# EAGLE design pt1MX (EAGLE 6.4)
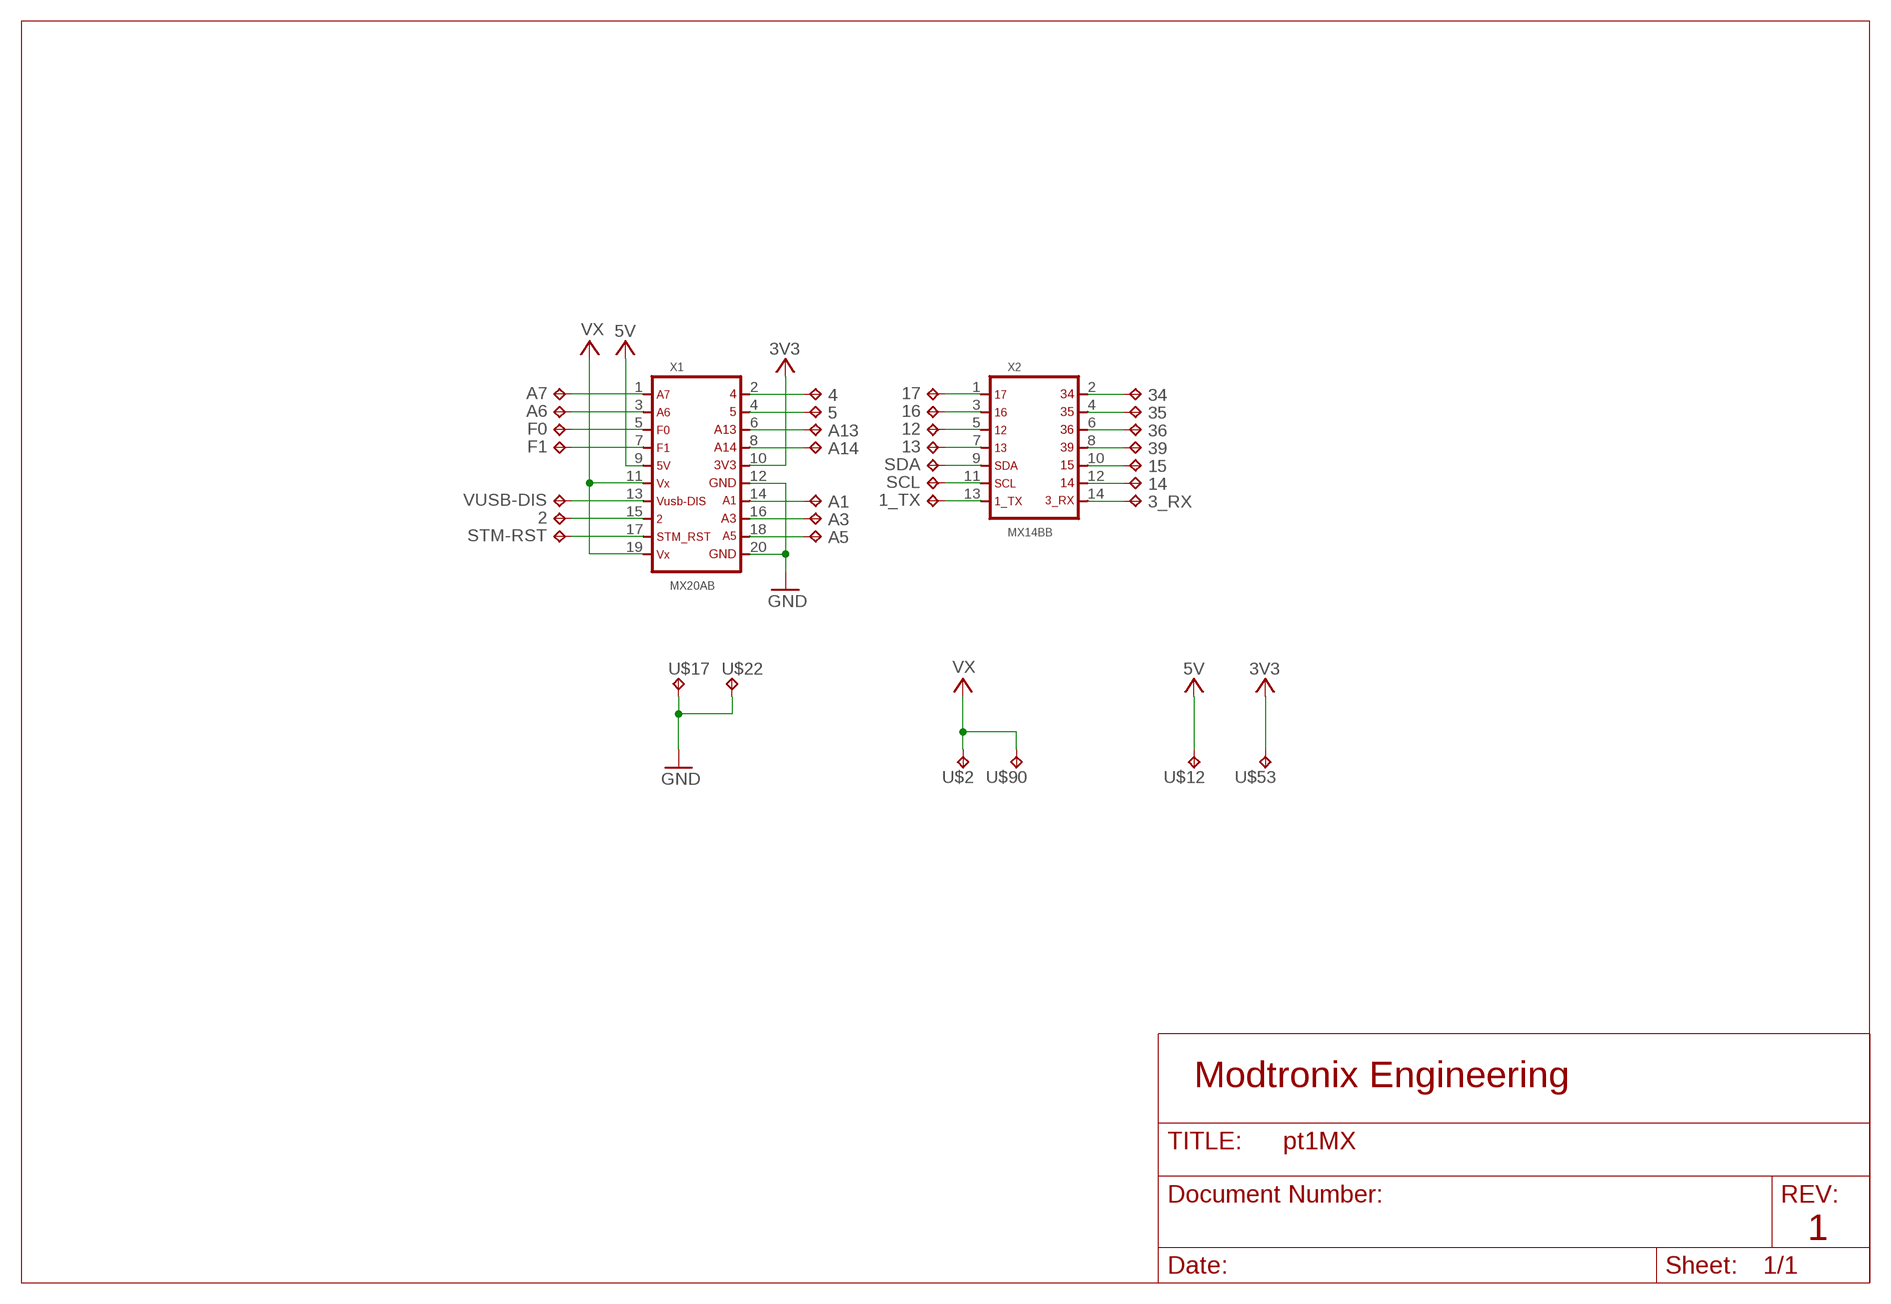
[diagram p0: schematic, sheet 1]

## Parts
1_TX  TPD10-D200  [TP-10-D200]
2  TPD10-D200  [TP-10-D200]
3_RX  TPD10-D200  [TP-10-D200]
4  TPD10-D200  [TP-10-D200]
5  TPD10-D200  [TP-10-D200]
12  TPD10-D200  [TP-10-D200]
13  TPD10-D200  [TP-10-D200]
14  TPD10-D200  [TP-10-D200]
15  TPD10-D200  [TP-10-D200]
16  TPD10-D200  [TP-10-D200]
17  TPD10-D200  [TP-10-D200]
34  TPD10-D200  [TP-10-D200]
35  TPD10-D200  [TP-10-D200]
36  TPD10-D200  [TP-10-D200]
39  TPD10-D200  [TP-10-D200]
A1  TPD10-D200  [TP-10-D200]
A3  TPD10-D200  [TP-10-D200]
A5  TPD10-D200  [TP-10-D200]
A6  TPD10-D200  [TP-10-D200]
A7  TPD10-D200  [TP-10-D200]
A13  TPD10-D200  [TP-10-D200]
A14  TPD10-D200  [TP-10-D200]
F0  TPD10-D200  [TP-10-D200]
F1  TPD10-D200  [TP-10-D200]
SCL  TPD10-D200  [TP-10-D200]
SDA  TPD10-D200  [TP-10-D200]
STM-RST  TPD10-D200  [TP-10-D200]
U$2  TPD10-D200  [TP-10-D200]
U$12  TPD10-D200  [TP-10-D200]
U$17  TPD10-D200  [TP-10-D200]
U$22  TPD10-D200  [TP-10-D200]
U$53  TPD10-D200  [TP-10-D200]
U$90  TPD10-D200  [TP-10-D200]
VUSB-DIS  TPD10-D200  [TP-10-D200]
X1  MX20AB  [MA10-2-NONUM]
X2  MX14BB  [MA07-2-NONUM]

## Nets
1_TX: 1_TX.1(TP) X2.13
2: 2.1(TP) X1.15
3_RX: 3_RX.1(TP) X2.14
3V3: U$53.1(TP) X1.10
4: 4.1(TP) X1.2
5: 5.1(TP) X1.4
5V [power]: U$12.1(TP) X1.9
12: 12.1(TP) X2.5
13: 13.1(TP) X2.7
14: 14.1(TP) X2.12
15: 15.1(TP) X2.10
16: 16.1(TP) X2.3
17: 17.1(TP) X2.1
34: 34.1(TP) X2.2
35: 35.1(TP) X2.4
36: 36.1(TP) X2.6
39: 39.1(TP) X2.8
A1: A1.1(TP) X1.14
A3: A3.1(TP) X1.16
A5: A5.1(TP) X1.18
A6: A6.1(TP) X1.3
A7: A7.1(TP) X1.1
A13: A13.1(TP) X1.6
A14: A14.1(TP) X1.8
F0: F0.1(TP) X1.5
F1: F1.1(TP) X1.7
GND [power]: U$17.1(TP) U$22.1(TP) X1.12 X1.20
SCL: SCL.1(TP) X2.11
SDA: SDA.1(TP) X2.9
STM-RST: STM-RST.1(TP) X1.17
VUSB-DIS: VUSB-DIS.1(TP) X1.13
VX [power]: U$2.1(TP) U$90.1(TP) X1.11 X1.19

## Notes on the sheet
- Modtronix Engineering
- 1

## Library data of the parts
1_TX 2 3_RX 4 5 12-17 34-36 39 A1 A3 A5-A7 A13 A14 F0 F1 SCL SDA STM-RST U$2 U$12 U$17 U$22 U$53 U$90 VUSB-DIS = mx-conn:TP
X1 = mx-conn:MX20A
X2 = mx-conn:MX14B

## Net classes
0 default: width 0.2 mm, drill 0.5 mm, clearance 0.2 mm
1 power: width 0.3 mm, drill 0.5 mm, clearance 0.2 mm

## Board
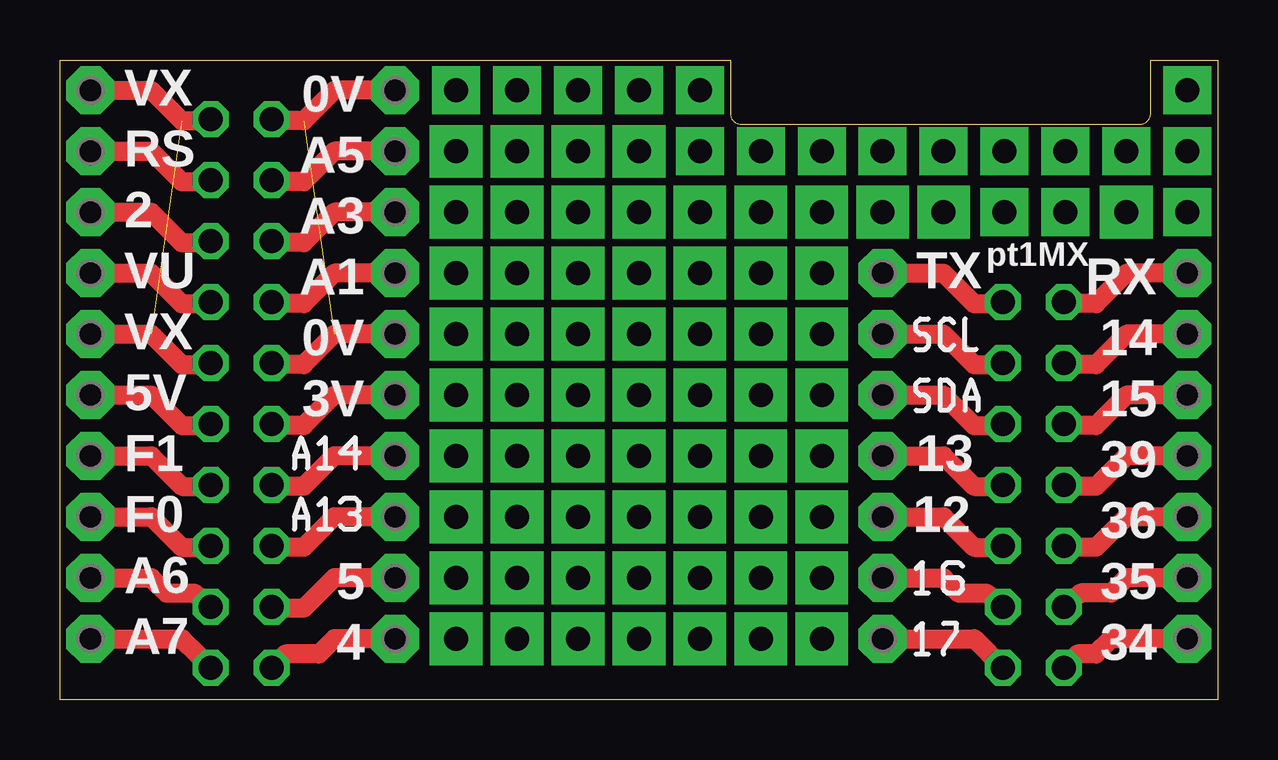
[diagram p1: board, top side]
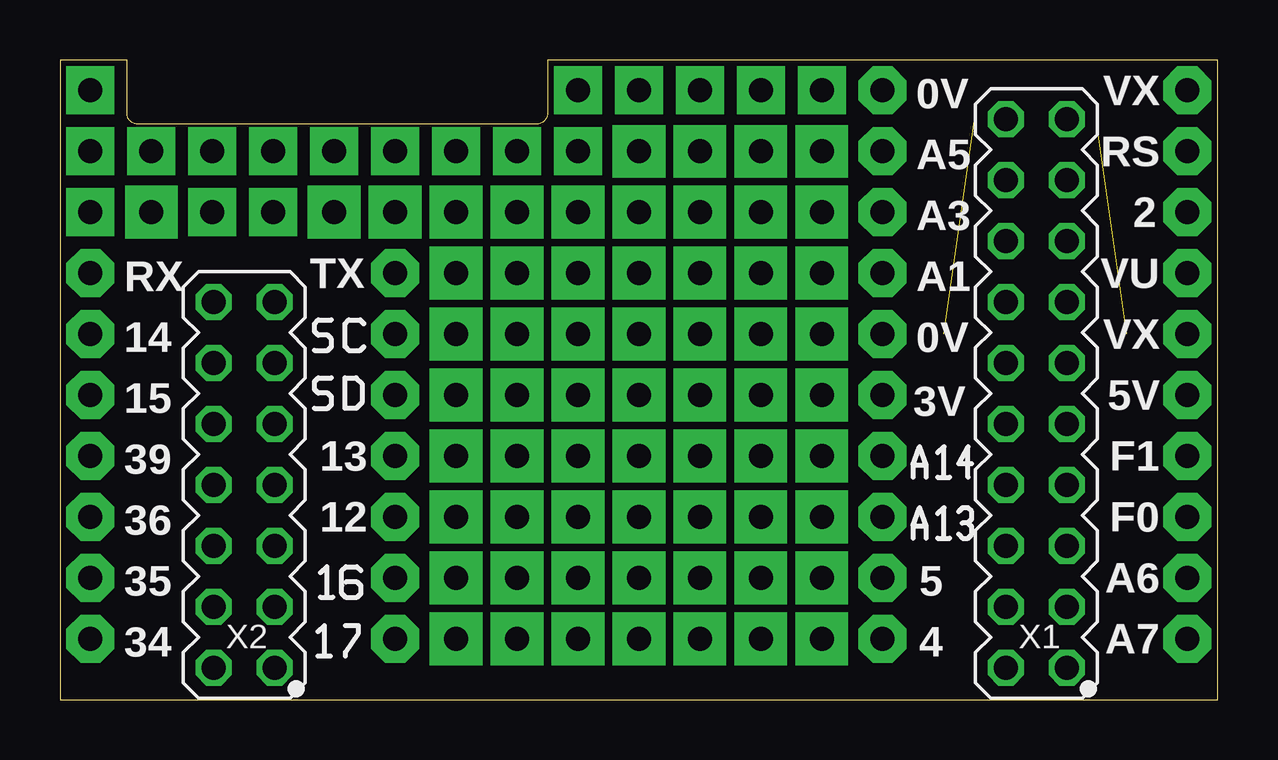
[diagram p2: board, bottom side, seen from below]

Size 48.26 x 26.67 mm. Coordinates in mm from the lower left corner, seen from the top.
Outline: 0,0 0,26.67 27.94,26.67 27.94,24.38 arc74 28.32,24 45.08,24 arc74 45.47,24.38 45.47,26.67 48.26,26.67 48.26,0 0,0
Copper layers (1*16): Top 0.035mm / dielectric 1.5mm / Bottom 0.035mm
Design rules "12w_10clr_24drl *": minimum track width 0.2mm, minimum drill 0.5mm, track to track 10mil, track to pad 10mil, pad to pad 10mil, via to via 12mil, smd to smd 6mil, copper to edge 0.1mm, drill to drill 0.1mm, minimum pad ring 0.2mm, minimum via ring 0.2mm, stop-mask expansion 4mil, vias tented up to drill 28mil, thermal gap 10mil

### Footprints (pad centres in the part's own frame; a part is rotated, then mirrored left to right if it is on the bottom)
TP-10-D200 = drill 1 pad 2 octagon: 1 0,0
MA10-2-NONUM = drill 1 octagon: 1 -11.43,-1.27; 2 -11.43,1.27; 3 -8.89,-1.27; 4 -8.89,1.27; 5 -6.35,-1.27; 6 -6.35,1.27; 7 -3.81,-1.27; 8 -3.81,1.27; 9 -1.27,-1.27; 10 -1.27,1.27; 11 1.27,-1.27; 12 1.27,1.27; 13 3.81,-1.27; 14 3.81,1.27; 15 6.35,-1.27; 16 6.35,1.27; 17 8.89,-1.27; 18 8.89,1.27; 19 11.43,-1.27; 20 11.43,1.27
MA07-2-NONUM = drill 1 octagon: 1 -7.62,-1.27; 2 -7.62,1.27; 3 -5.08,-1.27; 4 -5.08,1.27; 5 -2.54,-1.27; 6 -2.54,1.27; 7 0,-1.27; 8 0,1.27; 9 2.54,-1.27; 10 2.54,1.27; 11 5.08,-1.27; 12 5.08,1.27; 13 7.62,-1.27; 14 7.62,1.27

### Placement (x,y rotation side)
1_TX  34.29,17.78 270 top
2  1.27,20.32 270 top
3_RX  46.99,17.78 270 top
4  13.97,2.54 270 top
5  13.97,5.08 270 top
12  34.29,7.62 270 top
13  34.29,10.16 270 top
14  46.99,15.24 180 top
15  46.99,12.7 180 top
16  34.29,5.08 270 top
17  34.29,2.54 270 top
34  46.99,2.54 0 top
35  46.99,5.08 270 top
36  46.99,7.62 270 top
39  46.99,10.16 0 top
A1  13.97,17.78 270 top
A3  13.97,20.32 270 top
A5  13.97,22.86 270 top
A6  1.27,5.08 270 top
A7  1.27,2.54 270 top
A13  13.97,7.62 270 top
A14  13.97,10.16 270 top
F0  1.27,7.62 270 top
F1  1.27,10.16 270 top
SCL  34.29,15.24 270 top
SDA  34.29,12.7 270 top
STM-RST  1.27,22.86 270 top
U$1  [S-56N]  35.69,14.61 0 top
U$2  1.27,15.24 90 top
U$3  [ESP32MX_20-14P_0H_REF]  24.13,6.99 0 top
U$4  [S-56N]  35.69,12.07 0 top
U$5  [C-56N]  36.7,14.61 0 top
U$6  [D-56N]  36.7,12.07 0 top
U$7  [A-56N]  37.72,12.07 0 top
U$8  [L-56N]  37.72,14.61 0 top
U$9  [A-56N]  12.7,9.27 0 bottom
U$10  [A-56N]  9.78,9.65 0 top
U$11  [A-56N]  9.78,7.11 0 top
U$12  1.27,12.7 90 top
U$13  [A-56N]  12.7,6.73 0 bottom
U$14  [4-56N]  10.79,9.27 0 bottom
U$17  13.97,15.24 0 top
U$22  13.97,25.4 0 top
U$23  [3-56N]  10.79,6.73 0 bottom
U$37  [3-56]  11.68,7.11 0 top
U$39  [4-56]  11.68,9.65 0 top
U$41  [1-56N]  10.79,7.11 0 top
U$42  [1-56N]  10.79,9.65 0 top
U$48  [1-56N]  35.69,4.45 0 top
U$49  [6-56]  36.83,4.45 0 top
U$50  [1-56N]  35.69,1.91 0 top
U$51  [S-56]  37.65,12.14 0 bottom
U$52  [7-56N]  36.83,1.91 0 top
U$53  13.97,12.7 0 top
U$54  [S-56]  37.65,14.56 0 bottom
U$55  [D-56]  36.38,12.14 0 bottom
U$57  [C-56]  36.38,14.56 0 bottom
U$61  [1-56N]  37.4,4.27 0 bottom
U$62  [6-56]  36.51,4.27 0 bottom
U$63  [1-56N]  37.5,1.82 0 bottom
U$64  [7-56N]  36.36,1.82 0 bottom
U$68  [1-56N]  11.68,6.73 0 bottom
U$69  [1-56N]  11.68,9.27 0 bottom
U$90  1.27,25.4 0 top
VUSB-DIS  1.27,17.78 270 top
X1  7.56,12.77 90 bottom
X2  40.58,8.96 90 bottom

### Tracks (layer width: path | path; a pad name or v marks a point on that pad's centre or on a via)
1_TX
  Top 0.8: 1_TX.1 36.83,17.78 38.1,16.51 39.24,16.51 X2.13
2
  Top 0.8: 2.1 3.81,20.32 5.08,19.05 6.22,19.05 X1.15
3_RX
  Top 0.8: 3_RX.1 44.45,17.78 43.18,16.51 41.91,16.51 X2.14
3V3
  Top 0.8: U$53.1 11.43,12.7 10.16,11.43 8.89,11.43 X1.10
4
  Top 0.8: 4.1 11.43,2.54 10.79,1.91 9.4,1.91 X1.2
5
  Top 0.8: 5.1 11.43,5.08 10.16,3.81 8.89,3.81 X1.4
5V
  Top 0.8: U$12.1 3.81,12.7 5.08,11.43 6.22,11.43 X1.9
12
  Top 0.8: 12.1 36.83,7.62 38.1,6.35 39.24,6.35 X2.5
13
  Top 0.8: 13.1 36.83,10.16 38.1,8.89 39.24,8.89 X2.7
14
  Top 0.8: 14.1 44.45,15.24 43.18,13.97 41.91,13.97 X2.12
15
  Top 0.8: 15.1 44.45,12.7 43.18,11.43 41.91,11.43 X2.10
16
  Top 0.8: 16.1 36.83,5.08 37.47,4.45 38.61,4.45 X2.3
17
  Top 0.8: 17.1 38.1,2.54 X2.1
34
  Top 0.8: 34.1 43.81,2.54 43.18,1.91 42.42,1.91 X2.2
35
  Top 0.8: 35.1 44.45,5.08 43.81,4.45 42.55,4.45 X2.4
36
  Top 0.8: 36.1 44.45,7.62 43.18,6.35 41.91,6.35 X2.6
39
  Top 0.8: 39.1 44.45,10.16 43.18,8.89 41.91,8.89 X2.8
A1
  Top 0.8: A1.1 11.43,17.78 10.16,16.51 8.89,16.51 X1.14
A3
  Top 0.8: A3.1 11.43,20.32 10.16,19.05 8.89,19.05 X1.16
A5
  Top 0.8: A5.1 11.43,22.86 10.16,21.59 8.89,21.59 X1.18
A6
  Top 0.8: A6.1 3.81,5.08 4.45,4.45 5.59,4.45 X1.3
A7
  Top 0.8: A7.1 5.08,2.54 5.71,1.91 5.72,1.91 X1.1
A13
  Top 0.8: A13.1 11.43,7.62 10.16,6.35 8.89,6.35 X1.6
A14
  Top 0.8: A14.1 11.43,10.16 10.16,8.89 8.89,8.89 X1.8
F0
  Top 0.8: F0.1 3.81,7.62 5.08,6.35 6.22,6.35 X1.5
F1
  Top 0.8: F1.1 3.81,10.16 5.08,8.89 6.22,8.89 X1.7
GND  (1 unrouted)
  Top 0.8: U$17.1 11.43,15.24 10.16,13.97 8.89,13.97 X1.12 | U$22.1 11.43,25.4 10.16,24.13 8.89,24.13 X1.20
N$1  (via drill 1 pad 2.2)
  other vias: 21.59,10.16
N$2  (via drill 1 pad 2.2)
  other vias: 24.13,10.16
N$3  (via drill 1 pad 2.2)
  other vias: 26.67,10.16
N$4  (via drill 1 pad 2.2)
  other vias: 26.67,7.62
N$5  (via drill 1 pad 2.2)
  other vias: 24.13,7.62
N$6  (via drill 1 pad 2.2)
  other vias: 21.59,7.62
N$7  (via drill 1 pad 2.2)
  other vias: 21.59,5.08
N$8  (via drill 1 pad 2.2)
  other vias: 24.13,5.08
N$9  (via drill 1 pad 2.2)
  other vias: 26.67,5.08
N$255  (via drill 1 pad 2)
  other vias: 46.99,25.4
N$300  (via drill 1 pad 2)
  other vias: 44.45,22.86
N$301  (via drill 1 pad 2)
  other vias: 46.99,22.86
N$332  (via drill 1 pad 2)
  other vias: 34.29,22.86
N$333  (via drill 1 pad 2)
  other vias: 36.83,22.86
N$334  (via drill 1 pad 2.2)
  other vias: 44.45,20.32
N$335  (via drill 1 pad 2)
  other vias: 46.99,20.32
N$374  (via drill 1 pad 2)
  other vias: 16.51,25.4
N$375  (via drill 1 pad 2.2)
  other vias: 16.51,22.86
N$376  (via drill 1 pad 2.2)
  other vias: 19.05,22.86
N$377  (via drill 1 pad 2)
  other vias: 19.05,25.4
N$380  (via drill 1 pad 2)
  other vias: 21.59,25.4
N$381  (via drill 1 pad 2.2)
  other vias: 21.59,22.86
N$382  (via drill 1 pad 2.2)
  other vias: 34.29,20.32
N$383  (via drill 1 pad 2)
  other vias: 41.91,20.32
N$384  (via drill 1 pad 2)
  other vias: 39.37,20.32
N$385  (via drill 1 pad 2.2)
  other vias: 36.83,20.32
N$389  (via drill 1 pad 2.2)
  other vias: 29.21,5.08
N$394  (via drill 1 pad 2.2)
  other vias: 16.51,2.54
N$398  (via drill 1 pad 2.2)
  other vias: 31.75,2.54
N$399  (via drill 1 pad 2.2)
  other vias: 21.59,2.54
N$400  (via drill 1 pad 2.2)
  other vias: 29.21,2.54
N$401  (via drill 1 pad 2.2)
  other vias: 19.05,5.08
N$402  (via drill 1 pad 2.2)
  other vias: 16.51,5.08
N$403  (via drill 1 pad 2.2)
  other vias: 19.05,2.54
N$404  (via drill 1 pad 2.2)
  other vias: 24.13,2.54
N$405  (via drill 1 pad 2.2)
  other vias: 26.67,2.54
N$424  (via drill 1 pad 2.2)
  other vias: 16.51,7.62
N$425  (via drill 1 pad 2.2)
  other vias: 19.05,7.62
N$426  (via drill 1 pad 2.2)
  other vias: 19.05,10.16
N$430  (via drill 1 pad 2.2)
  other vias: 29.21,10.16
N$431  (via drill 1 pad 2.2)
  other vias: 31.75,10.16
N$434  (via drill 1 pad 2.2)
  other vias: 31.75,12.7
N$435  (via drill 1 pad 2.2)
  other vias: 29.21,12.7
N$436  (via drill 1 pad 2.2)
  other vias: 26.67,12.7
N$437  (via drill 1 pad 2.2)
  other vias: 24.13,12.7
N$438  (via drill 1 pad 2.2)
  other vias: 21.59,12.7
N$439  (via drill 1 pad 2.2)
  other vias: 19.05,12.7
N$440  (via drill 1 pad 2.2)
  other vias: 16.51,10.16
N$441  (via drill 1 pad 2.2)
  other vias: 16.51,12.7
N$444  (via drill 1 pad 2.2)
  other vias: 16.51,15.24
N$445  (via drill 1 pad 2.2)
  other vias: 16.51,17.78
N$448  (via drill 1 pad 2.2)
  other vias: 16.51,20.32
N$449  (via drill 1 pad 2.2)
  other vias: 19.05,20.32
N$450  (via drill 1 pad 2.2)
  other vias: 19.05,17.78
N$451  (via drill 1 pad 2.2)
  other vias: 19.05,15.24
N$452  (via drill 1 pad 2.2)
  other vias: 21.59,15.24
N$453  (via drill 1 pad 2.2)
  other vias: 21.59,17.78
N$454  (via drill 1 pad 2.2)
  other vias: 21.59,20.32
N$455  (via drill 1 pad 2.2)
  other vias: 24.13,17.78
N$456  (via drill 1 pad 2.2)
  other vias: 24.13,15.24
N$457  (via drill 1 pad 2.2)
  other vias: 26.67,15.24
N$458  (via drill 1 pad 2.2)
  other vias: 26.67,17.78
N$459  (via drill 1 pad 2.2)
  other vias: 29.21,17.78
N$460  (via drill 1 pad 2.2)
  other vias: 29.21,15.24
N$461  (via drill 1 pad 2.2)
  other vias: 31.75,15.24
N$462  (via drill 1 pad 2.2)
  other vias: 31.75,17.78
N$465  (via drill 1 pad 2)
  other vias: 41.91,22.86
N$466  (via drill 1 pad 2)
  other vias: 39.37,22.86
N$469  (via drill 1 pad 2.2)
  other vias: 31.75,7.62
N$470  (via drill 1 pad 2.2)
  other vias: 29.21,7.62
N$472  (via drill 1 pad 2.2)
  other vias: 31.75,5.08
N$475  (via drill 1 pad 2.2)
  other vias: 24.13,22.86
N$476  (via drill 1 pad 2)
  other vias: 26.67,22.86
N$477  (via drill 1 pad 2)
  other vias: 29.21,22.86
N$478  (via drill 1 pad 2)
  other vias: 31.75,22.86
N$479  (via drill 1 pad 2.2)
  other vias: 31.75,20.32
N$480  (via drill 1 pad 2.2)
  other vias: 29.21,20.32
N$481  (via drill 1 pad 2.2)
  other vias: 26.67,20.32
N$482  (via drill 1 pad 2.2)
  other vias: 24.13,20.32
N$485  (via drill 1 pad 2)
  other vias: 24.13,25.4
N$486  (via drill 1 pad 2)
  other vias: 26.67,25.4
SCL
  Top 0.8: SCL.1 36.83,15.24 38.1,13.97 39.24,13.97 X2.11
SDA
  Top 0.8: SDA.1 36.83,12.7 38.1,11.43 39.24,11.43 X2.9
STM-RST
  Top 0.8: STM-RST.1 3.81,22.86 5.08,21.59 6.22,21.59 X1.17
VUSB-DIS
  Top 0.8: VUSB-DIS.1 3.81,17.78 5.08,16.51 6.22,16.51 X1.13
VX  (1 unrouted)
  Top 0.8: U$90.1 3.81,25.4 5.08,24.13 6.22,24.13 X1.19 | U$2.1 3.81,15.24 5.08,13.97 6.22,13.97 X1.11

### Text on the board
tPlace: 0V | VX | A5 | RS | A3 | 2 | A1 | pt1MX | RX | VU | TX | 0V | 14 | VX | 3V | 15 | 5V | 39 | F1 | 13 | 36 | F0 | 12 | 5 | 35 | A6 | 4 | 34 | A7
bPlace: VX | 0V | RS | A5 | 2 | A3 | VU | TX | A1 | RX | VX | 0V | 14 | 5V | 3V | 15 | F1 | 13 | 39 | F0 | 12 | 36 | A6 | 5 | 35 | A7 | 4 | 34